# Altium schematic sheet 06 RS485.SchDoc: RS485
size 420 x 297 mm; SheetNumber: 6; SheetTotal: 6
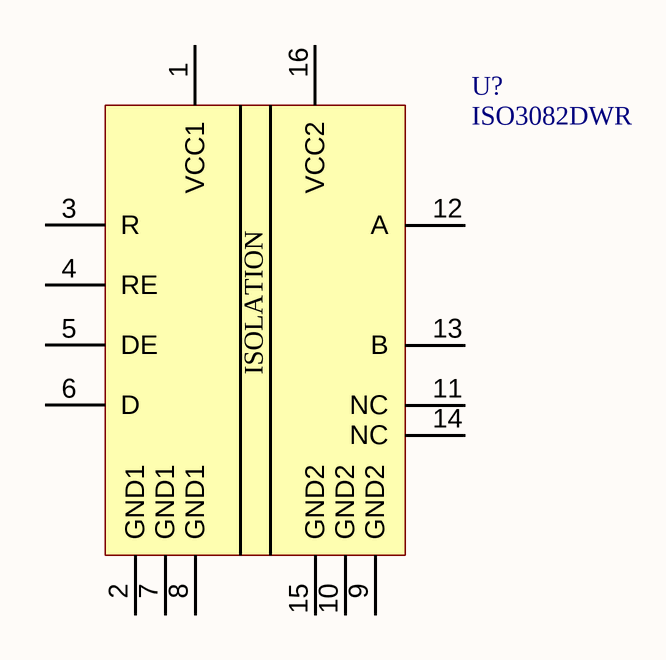
[diagram p0: 06 RS485.SchDoc]

## Parts
U?  ISO3082DWR  [SOIC127P1030X265-16N]

## Nets

Not connected (* = marked no-connect by the designer): U? 1(VCC1) 2(GND1) 3(R) 4(RE) 5(DE) 6(D) 7(GND1) 8(GND1) 9(GND2) 10(GND2) 11(NC) 12(A) 13(B) 14(NC) 15(GND2) 16(VCC2)

## Notes on the sheet
- Title
- Project
- Size
- Date
- Revision
- A3
- Designed By
- (in symbol ISO3082DWR) ISOLATION

## Library data of the parts
U? = ISO3082DWR: 2/2 Transceiver, Isolated Half RS422, RS485 16-SOIC; manufacturer: Texas Instruments; mfr_part_number: ISO3082DWR; assembler_number: ISO3082DWR; datasheet: https://www.ti.com/general/docs/suppproductinfo.tsp?distId=10&gotoUrl=https%3A%2F%2Fwww.ti.com%2Flit%2Fgpn%2Fiso3082